# EAGLE design AC dimmer HLK (EAGLE 7.3.0)
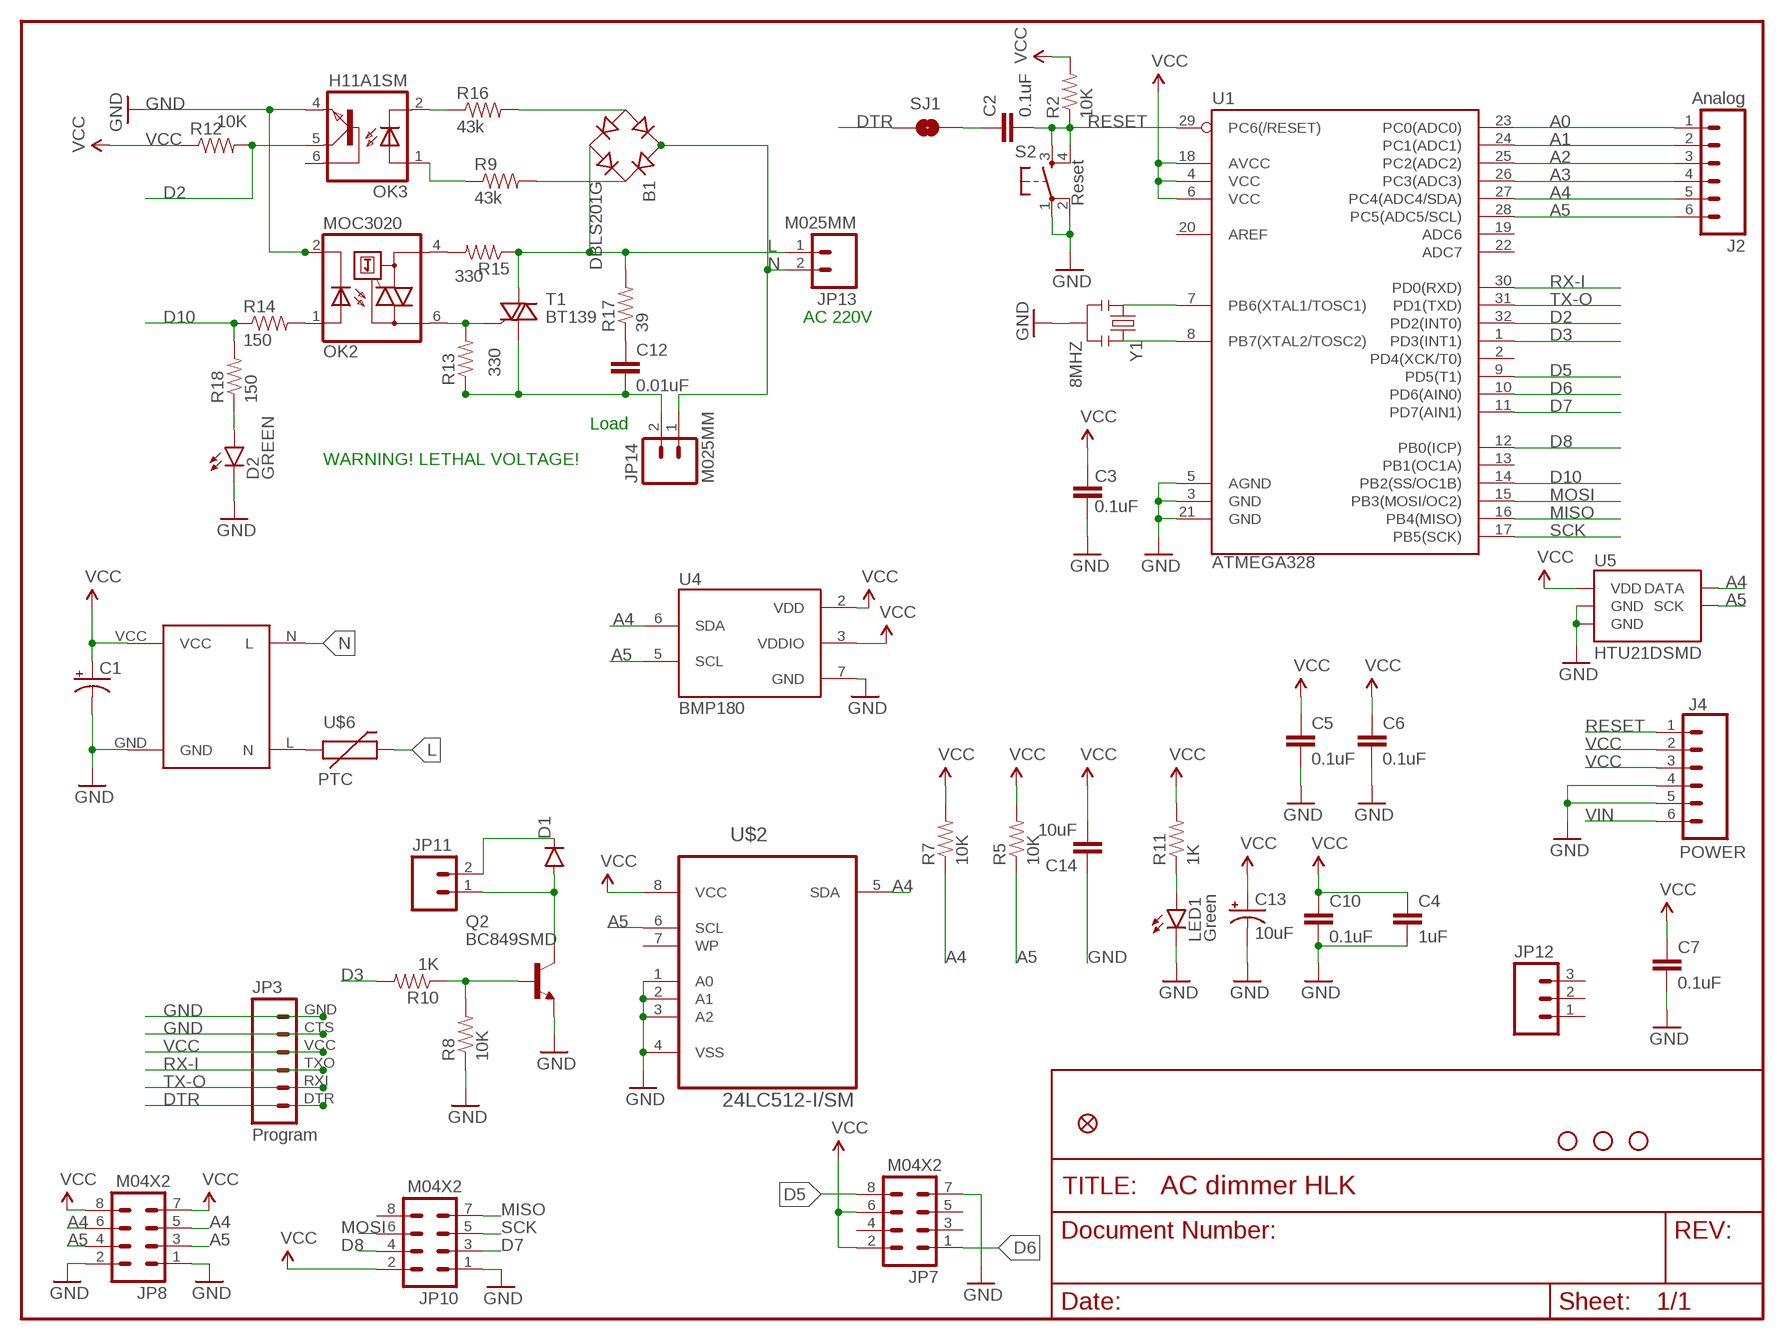
[diagram p0: schematic, sheet 1]

## Parts
B1  DBLS201G  [DBS]
C1  CAP_POL3528-KIT  [EIA3528-KIT]
C2  0.1uF  CAP0805  [0805]
C3  0.1uF  CAP0805  [0805]
C4  1uF  CAP0805  [0805]
C5  0.1uF  CAP0805  [0805]
C6  0.1uF  CAP0805  [0805]
C7  0.1uF  CAP0805  [0805]
C10  0.1uF  CAP0805  [0805]
C12  0.01uF  C-EUC1206  [C1206]
C13  10uF  CAP_POL1206  [EIA3216]
C14  10uF  CAP1206  [1206]
D1  DIODESOD  [SOD-323]
D2  GREEN  LED0603  [LED-0603]
J2  Analog  M06SIP  [1X06]
J4  POWER  M06SIP  [1X06]
JP2  FIDUCIAL1X2.5  [FIDUCIAL-1X2.5]
JP3  Program  M06SIP  [1X06]
JP7  M04X2  [2X4]
JP8  M04X2  [2X4]
JP10  M04X2  [2X4]
JP11  M02PTH  [1X02]
JP12  M03PTH  [1X03]
JP13  M025MM  [SCREWTERMINAL-5MM-2]
JP14  M025MM  [SCREWTERMINAL-5MM-2]
LED1  Green  LED0603  [LED-0603]
OK2  MOC3020  MOC3031S  [DIL6-SMD]
OK3  H11A1SM  [DIL6-SMD]
Q2  BC849SMD  [SOT23-BEC]
R2  10K  RESISTOR0805-RES  [0805]
R5  10K  RESISTOR0805-RES  [0805]
R7  10K  RESISTOR0805-RES  [0805]
R8  10K  RESISTOR0805-RES  [0805]
R9  43k  RESISTOR1206  [1206]
R10  1K  RESISTOR0805-RES  [0805]
R11  1K  RESISTOR0805-RES  [0805]
R12  RESISTOR0805-RES  [0805]
R13  RESISTOR1206  [1206]
R14  150  RESISTOR0805-RES  [0805]
R15  RESISTOR1206  [1206]
R16  43k  RESISTOR1206  [1206]
R17  39  RESISTOR1206  [1206]
R18  150  RESISTOR0805-RES  [0805]
S2  Reset  TAC_SWITCHSMD  [TACTILE_SWITCH_SMD]
SJ1  SOLDERJUMPERNC2  [SJ_2S-NOTRACE]
T1  BT139  BT136  [TO220AB]
U1  ATMEGA328  ATMEGA168  [TQFP32-08]
U4  BMP180  [BMP180]
U5  HTU21DSMD  [HTU21D]
U$2  24LC512-I/SM  [SOIC127P794X203-8N]
U$3  STAND-OFFTIGHT  [STAND-OFF-TIGHT]
U$5  AC-DCHLK01  [HLK-PM01]
U$6  PTC  [MC331XX]
U$9  STAND-OFFTIGHT  [STAND-OFF-TIGHT]
U$10  STAND-OFFTIGHT  [STAND-OFF-TIGHT]
Y1  8MHZ  RESONATOR8MHZ  [RESONATOR-SMD]

## Nets
A0: J2.1 U1.23(PC0(ADC0))
A1: J2.2 U1.24(PC1(ADC1))
A2: J2.3 U1.25(PC2(ADC2))
A3: J2.4 U1.26(PC3(ADC3))
A4: J2.5 JP8.5 JP8.6 R7.1 U1.27(PC4(ADC4/SDA)) U4.6(SDA) U5.DATA U$2.5(SDA)
A5: J2.6 JP8.3 JP8.4 R5.1 U1.28(PC5(ADC5/SCL)) U4.5(SCL) U5.SCK U$2.6(SCL)
D2: OK3.5(COL) R12.2 U1.32(PD2(INT0))
D3: R10.2 U1.1(PD3(INT1))
D5: JP7.8 U1.9(PD5(T1))
D6: JP7.1 U1.10(PD6(AIN0))
D7: JP10.3 U1.11(PD7(AIN1))
D8: JP10.4 U1.12(PB0(ICP))
D10: R14.1 R18.2 U1.14(PB2(SS/OC1B))
DTR: JP3.DTR SJ1.1
GND [vcc]: C1.C(-) C3.1 C4.2 C5.2 C6.2 C7.2 C10.2 C13.C(-) C14.1 D2.C J4.4 J4.5 JP3.CTS JP3.GND JP7.7 JP8.1 JP8.2 JP10.1 LED1.C OK2.2(C) OK3.4(EMI) Q2.E R8.1 S2.1 S2.2 U1.3(GND) U1.5(AGND) U1.21(GND) U4.7(GND) U5.7(GND) U5.GND U$2.1(A0) U$2.2(A1) U$2.3(A2) U$2.4(VSS) U$5.GND Y1.2
L: B1.AC2 JP13.1 R15.1 R17.2 T1.2(A2) U$6.P$2
MISO: JP10.7 U1.16(PB4(MISO))
MOSI: JP10.6 U1.15(PB3(MOSI/OC2))
N: B1.AC1 JP13.2 JP14.1 U$5.N(L)
N$1: C2.1 SJ1.2
N$3: U1.7(PB6(XTAL1/TOSC1)) Y1.1
N$4: U1.8(PB7(XTAL2/TOSC2)) Y1.3
N$5: OK3.1(A) R9.1
N$6: U$5.L(N) U$6.P$1
N$7: OK3.2(C) R16.1
N$8: LED1.A R11.1
N$9: B1.- R16.2
N$12: D1.A JP11.1 Q2.C
N$13: D1.C JP11.2
N$14: Q2.B R8.2 R10.1
N$16: B1.+ R9.2
N$28: C12.2 JP14.2 R13.1 T1.1(A1)
N$29: OK2.6(A2) R13.2 T1.3(G)
N$31: OK2.4(A1) R15.2
N$33: OK2.1(A) R14.2
N$37: C12.1 R17.1
N$38: D2.A R18.1
RESET: C2.2 J4.1 R2.1 S2.3 S2.4 U1.29(PC6(/RESET))
RX-I: JP3.TXO U1.30(PD0(RXD))
SCK: JP10.5 U1.17(PB5(SCK))
TX-O: JP3.RXI U1.31(PD1(TXD))
VCC: C1.A(+) C3.2 C4.1 C5.1 C6.1 C7.1 C10.1 C13.A(+) C14.2 J4.2 J4.3 JP3.VCC JP7.2 JP7.6 JP8.7 JP8.8 JP10.2 R2.2 R5.2 R7.2 R11.2 R12.1 U1.4(VCC) U1.6(VCC) U1.18(AVCC) U4.2(VDD) U4.3(VDDIO) U5.VDD U$2.8(VCC) U$5.VCC
VIN [vcc]: J4.6
Unconnected: JP7.3 JP7.4 JP7.5 JP10.8 JP12.1 JP12.2 JP12.3 OK3.6(BAS) U1.2(PD4(XCK/T0)) U1.13(PB1(OC1A)) U1.19(ADC6) U1.20(AREF) U1.22(ADC7) U$2.7(WP)

## Notes on the sheet
- AC 220V
- Load
- WARNING! LETHAL VOLTAGE!

## Library data of the parts
B1 = rectifier:DB?*G: Single Phase 1.0 AMP Glass Passivated Bridge Rectifier Taiwan Semiconductor Co.,Ltd. - TSC Source: http://www.taiwansemi.com/TSCbig5/ezcatfiles/cust/img/img/db101g.pdf http://www.ts.com.tw/db/pictures/modules/PDT/PDT060207001/DBLS201G.pdf
C1 = SparkFun-Capacitors:CAP_POL: Capacitor Polarized These are standard SMD and PTH capacitors. Normally 10uF, 47uF, and 100uF in electrolytic and tantalum varieties. Always verify the external diameter of the through hole cap, it varies with capacity, voltage, and manufacturer. The EIA devices should be standard.
C2-C7 C10 = SparkFun:CAP: Capacitor Standard 0603 ceramic capacitor, and 0.1" leaded capacitor.
C12 = rcl:C-EU: CAPACITOR, European symbol
C13 = SparkFun:CAP_POL: Capacitor Polarized These are standard SMD and PTH capacitors. Normally 10uF, 47uF, and 100uF in electrolytic and tantalum varieties. Always verify the external diameter of the through hole cap, it varies with capacity, voltage, and manufacturer. The EIA devices should be standard.
C14 = SparkFun-Capacitors:CAP: Capacitor Standard 0603 ceramic capacitor, and 0.1" leaded capacitor.
D1 = SparkFun-DiscreteSemi:DIODE: Diode These are standard reverse protection diodes and small signal diodes. SMA package can handle up to about 1A. SOD-323 can handle about 200mA. What the SOD-323 package when ordering, there are some mfgs out there that are 5-pin packages.; PROD_ID: DIO-09646
D2 LED1 = SparkFun-LED:LED: LEDs Standard schematic elements and footprints for 5mm, 3mm, 1206, and 0603 sized LEDs. 5mm - Spark Fun Electronics SKU : COM-00529 (and others)
J2 J4 = SparkFun:M06: Header 6 Standard 6-pin 0.1" header. Use with straight break away headers (SKU : PRT-00116), right angle break away headers (PRT-00553), swiss pins (PRT-00743), machine pins (PRT-00117), and female headers (PRT-00115). Molex polarized connector foot print use with SKU : PRT-08094 with associated ...
JP2 = abes:FIDUCIAL: Fiducial Alignment Points Various fiducial points for machine vision alignment.
JP3 = SparkFun-Connectors:M06: Header 6 Standard 6-pin 0.1" header. Use with straight break away headers (SKU : PRT-00116), right angle break away headers (PRT-00553), swiss pins (PRT-00743), machine pins (PRT-00117), and female headers (PRT-00115). Molex polarized connector foot print use with SKU : PRT-08094 with associated ...
JP7 JP8 JP10 = SparkFun-Connectors:M04X2: .1" header, two rows of four.
JP11 = SparkFun-Connectors:M02: Standard 2-pin 0.1" header. Use with - straight break away headers ( PRT-00116) - right angle break away headers (PRT-00553) - swiss pins (PRT-00743) - machine pins (PRT-00117) - female headers (PRT-00115) Molex polarized connector foot print use with: PRT-08233 with associated crimp pins and housings. 2.54_SCREWTERM for use with PRT-10571. 3.5mm Screw Terminal footprints for PRT-08084 5mm Screw Terminal footprints for use with PRT-08432
JP12 = SparkFun-Connectors:M03: Header 3 Standard 3-pin 0.1" header. Use with straight break away headers (SKU : PRT-00116), right angle break away headers (PRT-00553), swiss pins (PRT-00743), machine pins (PRT-00117), and female headers (PRT-00115). Molex polarized connector foot print use with SKU : PRT-08232 with associated crimp pins and housings.
JP13 JP14 = SparkFun-Connectors:M02: Standard 2-pin 0.1" header. Use with - straight break away headers ( PRT-00116) - right angle break away headers (PRT-00553) - swiss pins (PRT-00743) - machine pins (PRT-00117) - female headers (PRT-00115) Molex polarized connector foot print use with: PRT-08233 with associated crimp pins and housings. 2.54_SCREWTERM for use with PRT-10571. 3.5mm Screw Terminal footprints for PRT-08084 5mm Screw Terminal footprints for use with PRT-08432; STOREFRONT_ID: PRT-08432
OK2 = optocoupler:MOC30*: 6-Pin DIP Zero-Cross Optoisolators Triac Driver Output (250/400 Volt Peak) Source: Data sheet <http://www.fairchildsemi.com/ds/MO/MOC3031M.pdf> The old path of data sheet not more available 2013-05-06.; MF: FAIRCHILD SEMICONDUCTOR; MPN: MOC3031SM; OC_FARNELL: unknown; OC_NEWARK: 34C1335
OK3 = optocoupler:H11A*?M: General Purpose 6-Pin Phototransistor Optocouplers Source: http://www.fairchildsemi.com/ds/4N/4N35-M.pdf; OC_FARNELL: unknown; OC_NEWARK: unknown
Q2 = transistor-npn:BC849*: NPN Transistor
R2 R5 R7 R8 R10 R11 = SparkFun:RESISTOR: Resistor Basic schematic elements and footprints for 0603, 1206, and PTH resistors.
R9 R16 R17 = SparkFun-Resistors:RESISTOR: Resistor Basic schematic elements and footprints for 0603, 1206, and PTH resistors.; K: 45K
R12 = SparkFun-Resistors:RESISTOR: Resistor Basic schematic elements and footprints for 0603, 1206, and PTH resistors.; OHM: 10K
R13-R15 R18 = SparkFun-Resistors:RESISTOR: Resistor Basic schematic elements and footprints for 0603, 1206, and PTH resistors.; OHM: 330
S2 = SparkFun:TAC_SWITCH: Momentary Switch Button commonly used for reset or general input. Spark Fun Electronics SKU : COM-00097
SJ1 = SparkFun:SOLDERJUMPER: Solder Jumper Standard SMD solder jumper. Used to automate production. Two varients : Normally Open and Normally Closed are the same, but have different paste layers. NC will have a large amount of paste and should jumper during reflow.
T1 = triac:BT136: Triac BT136 series E sensitive gate Source: http://www.nxp.com/acrobat_download/datasheets/BT136_SERIES_E_2.pdf
U1 = SparkFun:ATMEGA168
U4 = SparkFun-Sensors:BMP180: BOSCH BMP180 DIGITAL BAROMETRIC PRESSURE SENSOR Web page: http://www.bosch-sensortec.com/en/homepage/products_3/environmental_sensors_1/bmp180_1/bmp180 Datasheet: http://ae-bst.resource.bosch.com/media/products/dokumente/bmp180/BST-BMP180-DS000-09.pdf The BMP180 is the function compatible successor of the BMP085, a new generation of high precision digital pressure sensors for consumer applications. The ultra-low power, low voltage electronics of the BMP180 is optimized for use in mobile phones, PDAs, GPS navigation devices and outdoor equipment. With a low altitude noise of merely 0.25m at fast conversion time, the BMP180 offers superior performance. The I2C interface allows for easy system integration with a microcontroller. The BMP180 is based on piezo-resistive technology for EMC robustness, high accuracy and linearity as well as long term stability. Key features: - Temperature measurement included - I2C interface - Fully calibrated - Pb-free, halogen-free and RoHS compliant, - MSL 1 Basic specs: Pressure range: 300 to 1100hPa (+9000m to -500m relating to sea level) Supply voltage: 1.8 to 3.6V (VDD), 1.62V to 3.6V (VDDIO) Package: LGA package with metal lid Small footprint: 3.6mm x 3.8mm Super-flat: 0.93mm height Low power: 5μA at 1 sample / sec. in standard mode Low noise: 0.06hPa (0.5m) in ultra low power mode, 0.02hPa (0.17m) advanced resolution mode Typical applications: - Enhancement of GPS navigation (dead-reckoning, slope detection, etc.) - In- and out-door navigation - Leisure and sports - Weather forecast - Vertical velocity indication (rise/sink speed)
U5 = SparkFun-Sensors:HTU21D
U$2 = 24LC512-I:24LC512-I/SM: 512K I2C Serial EEPROM; MPN: 24LC512-I/SM; OC_FARNELL: 9758038; OC_NEWARK: 62K0582; PACKAGE: SOIC-8; SUPPLIER: MICROCHIP
U$3 U$9 U$10 = SparkFun-Electromechanical:STAND-OFF: #4 Stand Off This is the mechanical footprint for a #4 phillips button head screw. Use the keepout ring to avoid running the screw head into surrounding components. SKU : PRT-00447
U$5 = Moja Knjižnica:AC-DCHLK01
U$6 = GeekAmmo:PTC: PTC Resettable Fuse
Y1 = SparkFun-FreqCtrl:RESONATOR: Resonator Small SMD resonator. Used, eg, on the Arduino Pro/ Pro Mini boards. 8MHz- XTAL-08895 16MHz- XTAL-08900; PROD_ID: XTAL-08895

## Net classes
0 default: width 0.203 mm
1 vcc: width 0.254 mm

## Board
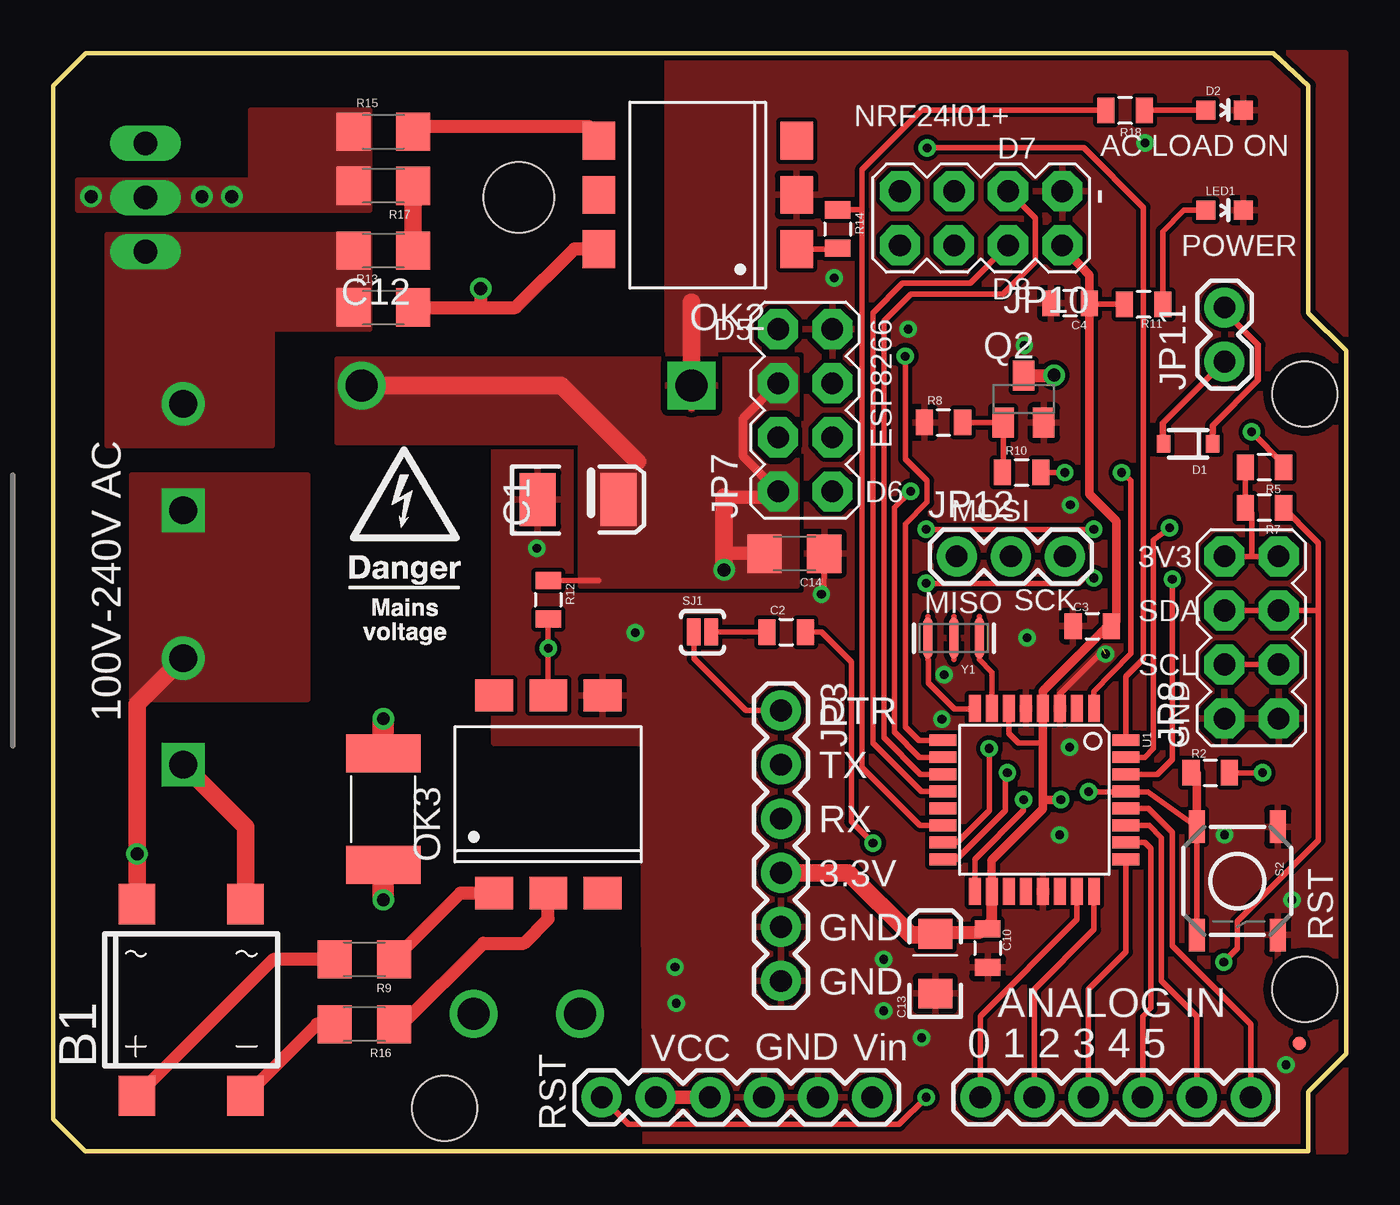
[diagram p1: board, top side]
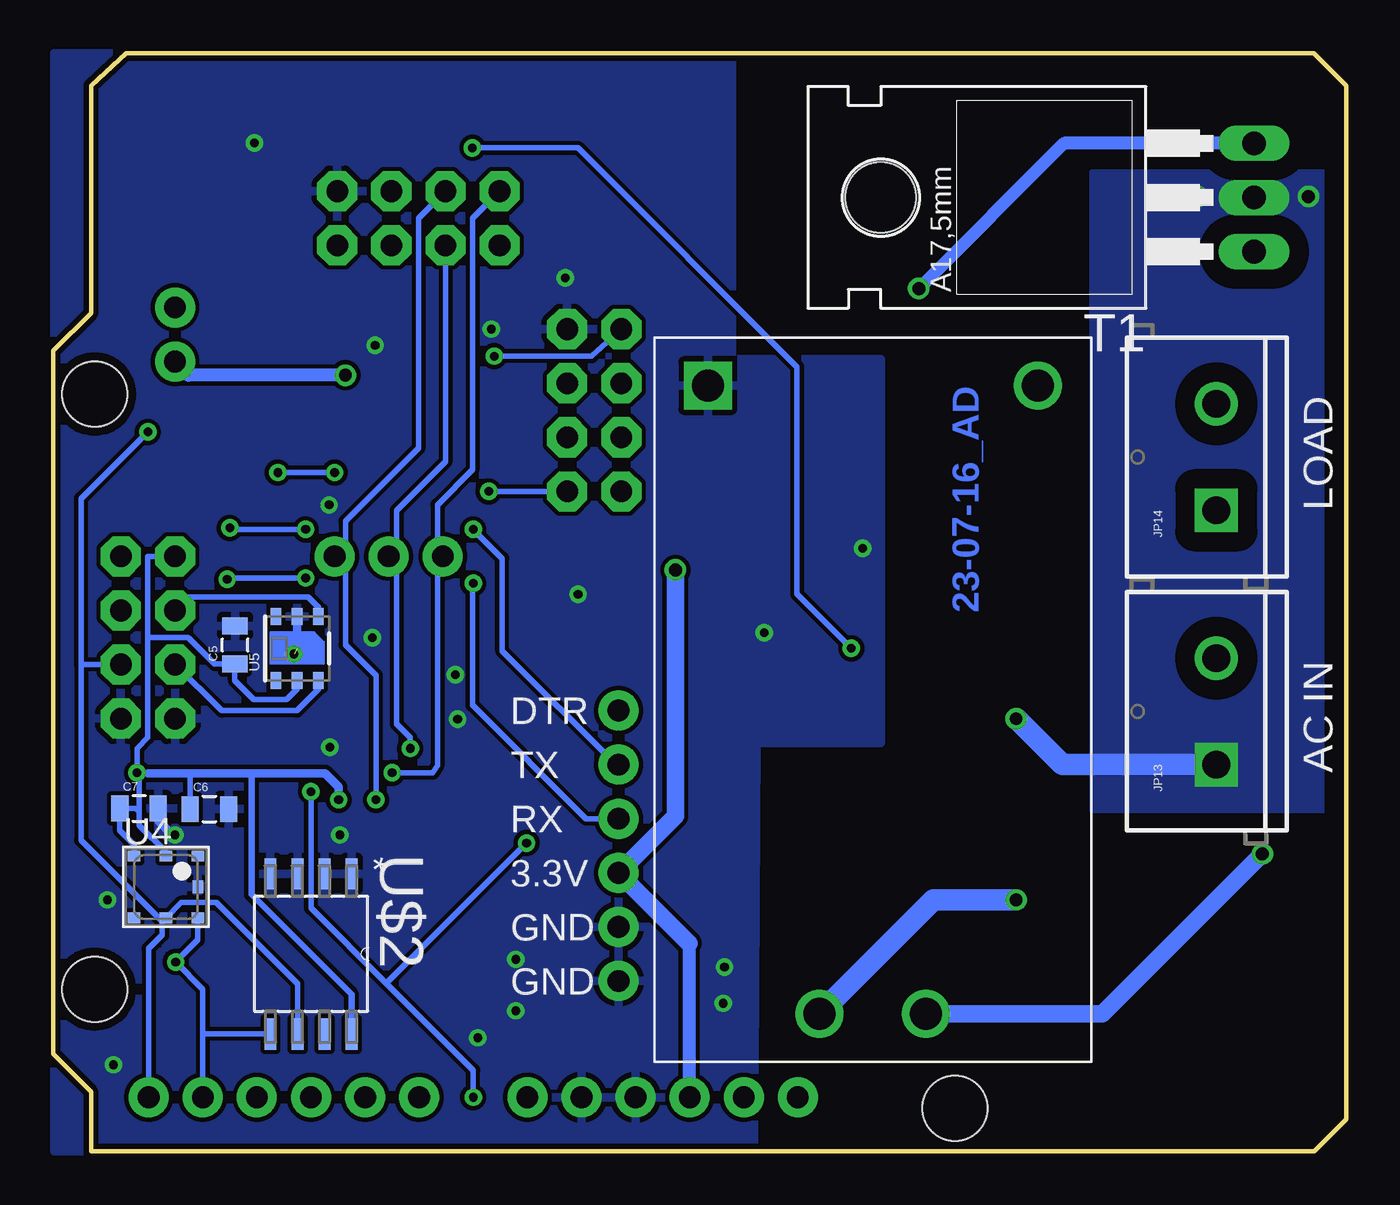
[diagram p2: board, bottom side, seen from below]

Size 60.71 x 51.56 mm. Coordinates in mm from the lower left corner, seen from the top.
Outline: 0,50.04 0,1.5 1.5,0 58.93,0 58.93,2.79 60.71,4.57 60.71,37.59 58.93,39.37 58.93,50.04 57.28,51.56 1.52,51.56 0,50.04
Copper layers (1*16): Top 0.035mm / dielectric 1.5mm / Bottom 0.035mm
Design rules "default *": minimum track width 10mil, minimum drill 24mil, track to track 8mil, track to pad 8mil, pad to pad 8mil, via to via 8mil, smd to smd 8mil, copper to edge 10mil, drill to drill 8mil, minimum pad ring 10mil, minimum via ring 8mil, stop-mask expansion 4mil, vias tented up to drill 20mil, thermal gap 10mil

### Footprints (pad centres in the part's own frame; a part is rotated, then mirrored left to right if it is on the bottom)
DBS = smd 1.7 x 1.9: + -2.55,-4.5; - 2.55,-4.5; AC1 -2.55,4.5; AC2 2.55,4.5
EIA3528-KIT = smd 1.7 x 2.5: A 1.9,0; C -1.9,0
0805 = smd 0.8 x 1.2: 1 -0.9,0; 2 0.9,0
C1206 = smd 1.6 x 1.8: 1 -1.4,0; 2 1.4,0
EIA3216 = smd 1.4 x 1.6: A 1.4,0; C -1.4,0
1206 = smd 1.6 x 1.8: 1 -1.4,0; 2 1.4,0
SOD-323 = smd 0.63 x 0.83: A 1.15,0; C -1.15,0
LED-0603 = smd 0.9 x 0.9: A 0,-0.877; C 0,0.877
1X06 = drill 1.016 pad 1.88: 1 0,0; 2 2.54,0; 3 5.08,0; 4 7.62,0; 5 10.16,0; 6 12.7,0
FIDUCIAL-1X2.5 = smd 0.635 x 0.635: 1 0,0
1X06' = drill 1.016 pad 1.88: CTS 10.16,0; DTR 0,0; GND 12.7,0; RXI 2.54,0; TXO 5.08,0; VCC 7.62,0
2X4 = drill 1.016 pad 1.88 octagon: 1 -3.81,-1.27; 2 -3.81,1.27; 3 -1.27,-1.27; 4 -1.27,1.27; 5 1.27,-1.27; 6 1.27,1.27; 7 3.81,-1.27; 8 3.81,1.27
1X02 = drill 1.016 pad 1.88: 1 0,0; 2 2.54,0
1X03 = drill 1.016 pad 1.88: 1 0,0; 2 2.54,0; 3 5.08,0
SCREWTERMINAL-5MM-2 = drill 1.3 pad 2.032 square: 1 0,0 | drill 1.3 pad 2.032: 2 5,0
DIL6-SMD = smd 1.78 x 1.52: 1 -2.54,-4.645; 2 0,-4.645; 3 2.54,-4.645; 4 2.54,4.645; 5 0,4.645; 6 -2.54,4.645
SOT23-BEC = smd 1 x 1.4: B -0.95,-1.1; C 0,1.1; E 0.95,-1.1
TACTILE_SWITCH_SMD = smd 1.524 x 0.762: 1 -2.54,1.905; 2 2.54,1.905; 3 -2.54,-1.905; 4 2.54,-1.905
SJ_2S-NOTRACE = smd 0.635 x 1.27: 1 -0.401,0; 2 0.413,0
TO220AB = drill 1.118 long: 1 -2.54,-6.35; 2 0,-6.35; 3 2.54,-6.35 | hole 3.302: 0,11.176
TQFP32-08 = smd 1.27 x 0.559: 1 -4.293,2.8; 2 -4.293,2; 3 -4.293,1.2; 4 -4.293,0.4; 5 -4.293,-0.4; 6 -4.293,-1.2; 7 -4.293,-2; 8 -4.293,-2.8; 17 4.293,-2.8; 18 4.293,-2; 19 4.293,-1.2; 20 4.293,-0.4; 21 4.293,0.4; 22 4.293,1.2; 23 4.293,2; 24 4.293,2.8 | smd 0.559 x 1.27: 9 -2.8,-4.293; 10 -2,-4.293; 11 -1.2,-4.293; 12 -0.4,-4.293; 13 0.4,-4.293; 14 1.2,-4.293; 15 2,-4.293; 16 2.8,-4.293; 25 2.8,4.293; 26 2,4.293; 27 1.2,4.293; 28 0.4,4.293; 29 -0.4,4.293; 30 -1.2,4.293; 31 -2,4.293; 32 -2.8,4.293
BMP180 = smd 0.6 x 0.5: 1 1.5,1.45; 2 0,1.45; 3 -1.5,1.45; 4 -1.5,-1.45; 5 0,-1.45; 6 1.5,-1.45 | smd 0.5 x 0.6: 7 1.5,0
HTU21D = smd 0.2 x 0.2: 7 0,0 | smd 0.8 x 0.5: DATA 1.5,-1; GND 1.5,0; NC@1 -1.5,1; NC@6 1.5,1; SCK -1.5,-1; VDD -1.5,0
SOIC127P794X203-8N = smd 1.473 x 0.559: 1 -3.759,1.905; 2 -3.759,0.635; 3 -3.759,-0.635; 4 -3.759,-1.905; 5 3.759,-1.905; 6 3.759,-0.635; 7 3.759,0.635; 8 3.759,1.905
STAND-OFF-TIGHT = hole 3.048: 0,0
HLK-PM01 = drill 1.5 square: GND 14.75,7.75 | drill 1.5: L -14.75,2.5; N -14.75,-2.5; VCC 14.75,-7.75
MC331XX = smd 1.78 x 3.5: P$1 0,0; P$2 5.23,0
RESONATOR-SMD = smd 0.45 x 1.905: 1 -1.2,0; 2 0,0; 3 1.2,0

### Placement (x,y rotation side)
B1  6.48,7.11 0 top
C1  24.64,30.61 0 top
C2  34.42,24.38 0 top
C3  48.78,24.66 0 top
C4  47.74,39.83 180 top
C5  52.17,23.78 90 bottom
C6  53.37,16.08 0 bottom
C7  56.67,16.11 0 bottom
C10  43.87,9.54 270 top
C12  15.49,42.29 180 top
C13  41.41,8.81 90 top
C14  34.8,28.07 180 top
D1  53.28,33.23 180 top
D2  54.99,48.9 270 top
J2  43.53,2.54 0 top
J4  25.75,2.54 0 top
JP2  58.51,5.08 90 top
JP3  Program  [1X06']  34.16,20.7 270 top
JP7  35.31,34.8 90 top
JP8  56.26,24.13 90 top
JP10  43.56,43.81 180 top
JP11  54.99,37.08 90 top
JP12  42.42,27.94 0 top
JP13  6.1,18.16 90 bottom
JP14  6.1,30.1 90 bottom
LED1  54.99,44.2 270 top
OK2  30.25,44.91 90 top
OK3  23.24,16.76 0 top
Q2  45.55,35.32 0 top
R2  54.32,17.78 0 top
R5  56.86,32.13 180 top
R7  56.86,30.23 180 top
R8  41.8,34.23 0 top
R9  14.61,9.02 180 top
R10  45.47,31.88 0 top
R11  51.18,39.77 180 top
R12  23.24,25.91 270 top
R13  15.49,39.62 0 top
R14  36.83,43.31 270 top
R15  15.49,47.88 0 top
R16  14.61,5.97 180 top
R17  15.49,45.34 180 top
R18  50.33,48.88 180 top
S2  55.59,12.7 270 top
SJ1  30.48,24.38 0 top
T1  10.68,44.79 90 bottom
U1  46.07,16.51 270 top
U4  55.41,12.42 0 bottom
U5  49.25,23.61 90 bottom
U$2  48.61,9.27 270 bottom
U$3  18.38,2.03 0 top
U$4  [WARNING_02]  11.18,22.99 0 top
U$5  22.23,21.21 90 bottom
U$6  15.49,13.46 90 top
U$9  58.77,35.56 0 top
U$10  58.77,7.62 0 top
Y1  42.27,24.11 180 top

### Tracks (layer width: path | path; a pad name or v marks a point on that pad's centre or on a via)
A0
  Top 0.254: U1.23 48.07,10.89 43.53,6.35 | J2.1 43.53,6.35 | 43.54,6.31 43.53,6.35
A1
  Top 0.254: U1.24 48.87,10.42 46.07,7.62 J2.2
A2
  Top 0.254: U1.25 50.36,9.37 48.61,7.62 48.61,2.79 48.73,2.67 J2.3
A3
  Top 0.254: U1.26 51.24,14.51 51.53,14.22 51.53,6.73 51.15,6.35 J2.4
A4  (via drill 0.41)
  Top 0.254: U1.27 51.46,15.31 52.03,14.73 52.03,8 53.69,6.35 J2.5 | R7.1 57.51,30.46 59.4,28.57 59.4,25.4 | 59.4,25.4 JP8.5 JP8.6 | 59.4,25.4 59.4,14.61 55.59,10.79 55.59,9.53 v54.96,8.89
  Bottom 0.254: 53.69,5.46 53.69,7.62 v54.96,8.89 53.91,9.93 U4.6 | 53.69,5.46 J2.5 | U5.DATA 48.26,25.54 48.74,26.02 54.34,26.02 JP8.6 | U$2.5 53.63,5.51 53.69,5.46
A5  (via drill 0.41)
  Top 0.254: U1.28 51.42,16.11 52.54,14.99 52.54,9.65 56.23,5.97 J2.6 | JP8.4 JP8.3 | R5.1 57.76,32.28 v56.26,33.78
  Bottom 0.254: JP8.3 59.4,22.86 | 59.4,22.86 59.4,14.61 55.59,10.79 | J2.6 56.23,9.53 55.59,10.16 55.59,10.79 | 59.4,22.86 59.4,30.66 58.62,31.42 v56.26,33.78 | JP8.4 52.79,20.7 49.26,20.7 48.26,21.71 U5.SCK | 55.59,10.79 U4.5 54.7,11.68 53.05,11.68 49.24,7.87 U$2.6
D2  (via drill 0.41)
  Top 0.254: U1.32 50.36,22.29 51.18,23.11 51.18,44.32 48.39,47.12 v41.02,47.12 | R12.2 v23.24,23.62 OK3.5
  Bottom 0.254: v41.02,47.12 36.07,47.12 25.78,36.83 25.78,26.16 v23.24,23.62
D3  (via drill 0.41)
  Top 0.254: v50.16,31.88 50.6,31.5 50.59,23.53 50.59,23.37 48.87,21.6 U1.1 | R10.2 v47.5,31.88
  Bottom 0.254: v47.5,31.88 v50.16,31.88
D5  (via drill 0.41)
  Top 0.254: 41.88,19.3 41.78,19.3 40.64,19.3 40.01,19.94 40.01,29.46 41.02,30.48 41.02,31.5 40.01,32.51 v40.01,37.34
  Top 0.406: U1.9 41.78,19.31 41.78,19.3
  Bottom 0.254: JP7.8 35.43,37.34 v40.01,37.34
D6  (via drill 0.41)
  Top 0.254: U1.10 40.67,18.51 39.5,19.68 39.5,30.23 v40.26,30.99
  Bottom 0.254: JP7.1 v40.26,30.99
D7
  Top 0.254: U1.11 40.71,17.71 38.99,19.43 38.99,38.99 40.26,40.26 44.58,40.26 46.1,41.78 46.1,43.81 JP10.3
D8
  Top 0.254: U1.12 40.75,16.91 38.48,19.18 38.48,39.37 39.88,40.77 43.05,40.77 JP10.4
D10
  Top 0.254: U1.14 40.7,15.31 37.98,18.03 37.98,24.64 37.97,25.4 37.97,44.21 | R18.2 40.75,48.88 37.97,46.1 37.97,44.21 | R14.1 37.97,44.21
DTR
  Top 0.254: SJ1.1 30.08,23.13 32.51,20.7 JP3.DTR
GND  (via drill 0.41)  (1 unrouted)
  Top 0.254: C14.1 36.2,26.42 36.2,26.16 v36.07,26.16
  Top 0.305: v49.4,23.35 49.13,23.35 47.27,21.48 U1.3
  Top 0.813: 29.97,35.18 29.97,39.88
  Bottom 0.406: v54.99,14.86 55.14,14.89 55.78,15.54 C7.2 | U5.GND U5.7
  other vias: 41.83,22.38 45.59,37.85 57.88,4.06 47.72,18.97 38.99,9.02 45.72,24.12 40.77,5.33 38.99,6.6 51.25,47.35 58.17,11.81 29.25,6.95 27.32,24.36 29.19,8.65 41.72,20.3 47.75,30.35 36.67,41.02 40.13,38.61 22.7,28.32 47.24,14.86
  pour Top (rank 6): 20.7,37.21 28.83,37.21 28.83,51.56 60.67,51.56 60.67,0 27.81,0 27.69,19.18 20.7,19.18
  pour Bottom: 21.84,37.21 28.83,37.21 28.83,51.56 60.67,51.56 60.67,0 27.81,0 27.69,19.18 21.84,19.18
L  (via drill 0.6)
  Top 0.813: B1.AC2 9.03,15.23 JP13.1
  Top 1.016: U$6.P$2 v15.49,20.32
  Bottom 1.016: JP13.1 13.34,18.16 v15.49,20.32
  other vias: 1.78,44.83 6.99,44.83 8.38,44.83
  pour Bottom (isolate 0.914, no thermals): 0.76,16 0.64,45.97 11.94,45.97 11.94,16
  pour Top (no thermals): 1.14,44.2 14.86,44.2 14.86,48.9 9.27,48.9 9.27,45.59 1.14,45.59
MISO  (via drill 0.41)
  Top 0.254: v44.8,17.78 44.96,17.78 44.7,17.53 44.7,16 42.41,13.71 U1.16
  Bottom 0.254: v44.8,17.78 42.89,17.78 42.67,18.13 42.67,30.35 41.02,32 41.02,43.81 JP10.7
MOSI  (via drill 0.41)
  Top 0.254: 41.88,14.48 41.8,14.48 U1.15 42.45,14.51 43.94,16 v43.94,18.92
  Top 0.406: 41.8,14.48 41.77,14.48
  Bottom 0.254: JP10.6 42.29,32.38 44.58,30.1 44.58,20.07 43.94,19.43 v43.94,18.92
N  (via drill 0.6)
  Top 0.813: JP13.2 3.94,21 v3.94,13.97 3.94,11.62 B1.AC1
  Bottom 0.813: U$5.N 11.45,6.46 v3.94,13.97
  pour Top (isolate 0.61, no thermals): 3.68,21.21 11.94,21.21 11.94,31.75 3.68,31.75
N$1
  Top 0.254: C2.1 32.45,24.38 SJ1.2
N$3
  Top 0.254: U1.7 44.07,22.5 43.47,23.09
N$4
  Top 0.254: U1.8 43.24,20.78 42.3,20.78 41.08,22 41.08,23.09 41.07,23.09
N$5
  Top 0.61: OK3.1 19.11,12.12 R9.1
N$6  (via drill 0.6)
  Top 1.016: U$6.P$1 v15.49,11.81
  Bottom 1.016: v15.49,11.81 19.37,11.81 U$5.L
N$7
  Top 0.61: R16.1 16.38,5.97 20.19,9.78 22.1,9.78 23.24,10.92 OK3.2
N$8
  Top 0.254: R11.1 52.09,43.2 53.09,44.2 LED1.A
N$9
  Top 0.61: R16.2 12.38,5.97 B1.-
N$12  (via drill 0.6)
  Top 0.254: Q2.C 45.59,36.42
  Top 0.305: 52.1,33.36 52.1,33.23 52.1,33.27 | JP11.1 52.1,34.19 52.1,33.27 | D1.A 52.13,33.24 52.1,33.27
  Top 0.61: 45.59,36.42 46.99,36.42 v46.99,36.45
  Bottom 0.61: v46.99,36.45 54.36,36.45 JP11.1
N$13
  Top 0.305: D1.C 54.43,34.08 56.56,36.21 56.56,37.88 54.99,39.45 JP11.2
N$14
  Top 0.254: R8.2 Q2.B 44.6,31.92 R10.1
N$16
  Top 0.61: R9.2 10.33,9.02 B1.+
N$22
  pour Bottom: 43.56,28.32 43.81,28.32 43.81,27.56 43.56,27.56
N$23
  pour Bottom: 46.1,28.32 46.35,28.32 46.35,27.56 46.1,27.56
N$28
  pour Top (isolate 0.406, no thermals): 2.54,43.05 14.86,43.05 14.86,38.61 10.29,38.61 10.29,33.15 2.54,33.15
N$29  (via drill 0.6)
  Top 0.61: R13.2 20.07,39.62 | 20.07,39.62 21.72,39.62 24.46,42.37 OK2.6 | v20.07,40.51 20.07,39.62
  Bottom 0.61: T1.3 13.25,47.33 v20.07,40.51
N$31
  Top 0.61: R15.2 16.89,48.13 25.15,48.13 25.57,47.45 OK2.4
N$33
  Top 0.254: OK2.1 36.7,42.37 R14.2
N$37
  Top 0.813: C12.1 R17.1
N$38
  Top 0.254: D2.A 51.24,48.9 R18.1
RESET  (via drill 0.41)
  Top 0.254: J4.1 27.02,1.27 39.72,1.27 v40.99,2.54 | v48.61,16.89 50.26,16.89 50.28,16.91 U1.29 50.49,16.91 50.51,16.89 51.4,16.89 S2.3 S2.4 | C2.2 35.97,24.38 | 35.97,24.38 35.94,24.38 | v38.48,14.48 37.47,15.49 37.47,22.99 36.07,24.38 35.97,24.38
  Top 0.406: R2.1 53.69,17.78 S2.3
  Bottom 0.254: 45.07,7.89 40.99,3.81 v40.99,2.54 | 45.07,7.89 48.61,11.43 v48.61,16.89 | v38.48,14.48 45.07,7.89
RX-I  (via drill 0.41)
  Top 0.254: U1.30 51.84,17.71 52.54,18.41 v52.54,26.86 | v40.99,26.67 48.13,26.67 48.39,26.92 v48.86,26.92
  Bottom 0.254: v52.54,26.86 52.29,26.92 v48.86,26.92 | JP3.TXO 35.69,15.62 41.02,20.95 41.02,26.64 v40.99,26.67
SCK  (via drill 0.41)
  Top 0.254: v45.56,16.51 45.56,16 43.27,13.71 U1.17
  Bottom 0.254: v45.56,16.51 45.56,22.35 46.99,23.78 46.99,29.59 43.56,33.02 43.56,43.81 JP10.5
TX-O  (via drill 0.41)
  Top 0.254: U1.31 51.24,18.51 51.65,18.92 51.65,28.7 v52.42,29.27 | v40.99,29.21 v48.86,29.21
  Bottom 0.254: v52.42,29.27 52.16,29.21 v48.86,29.21 | JP3.RXI 34.29,18.16 39.62,23.5 39.62,27.85 v40.99,29.21
VCC  (via drill 0.41, 0.6)
  Top 0.254: 43.53,10.29 C10.1 | U1.18 44.06,12.22 | 46.47,20.9 U1.4 | U1.6 44.87,19.61 45.3,19.18 46.47,19.18 | R2.2 v56.77,17.78 | JP8.8 56.26,27.94 | 56.26,27.94 JP8.7 | R5.2 R7.2 56.26,29.97 56.26,27.94 | R11.2 48.7,39.77 C4.1 | R12.1 25.6,26.81
  Top 0.406: 44.06,12.22 44.05,13.66 46.46,16.07 46.47,16.51 | 46.47,16.51 46.47,19.18 U1.4 | 46.47,16.51 v47.31,16.51 | C4.1 48.65,40.33 48.65,41.15 47.34,42.52 JP10.2 | 48.61,39.37 C4.1 | U1.4 46.47,20.83 46.47,21.61 49.52,24.66 C3.2 49.91,24.89 49.91,29.59 48.64,30.86 C4.1 | J4.3 31.24,2.54 | JP7.6 32.38,34.42 32.38,32.64 JP7.2
  Top 0.508: U1.18 44.07,10.83 43.53,10.29
  Top 0.61: 41.11,10.29 43.53,10.29 | 41.16,10.27 C13.A 41.35,10.16 | JP7.2 33.78,30.73 31.5,30.73 31.49,28.07 C14.2
  Top 0.635: 41.11,10.29 C13.A | J4.2 J4.3
  Top 0.813: JP3.VCC 37.34,13.08 40.26,10.16 41.35,10.16 | U$5.VCC 23.86,35.96 27.43,32.38 | v31.5,27.3 31.5,30.73
  Bottom 0.254: 56.25,17.75 v56.77,17.78 | JP8.8 56.26,27.94 56.26,24.13 | 56.26,24.13 56.26,19.43 56.77,18.92 v56.77,17.78 | 56.26,24.13 56.11,24.13 54.4,24.13 54.37,24.1 54.34,24.1 53.12,22.88 C5.1 52.18,22.11 51.29,21.22 49.75,21.22 49.26,21.72 U5.VDD | U4.2 55.41,14.06 56.67,15.32 56.67,15.96 | 56.67,15.96 56.67,17.76 v56.77,17.78 | 56.67,15.96 56.82,16.11 C7.1 57.59,16.09 57.59,15.06 56.91,14.39 U4.3 | C6.1 54.27,17.68 54.35,17.75
  Bottom 0.305: U$2.8 46.7,7.37 51.4,12.06 51.4,17.75
  Bottom 0.406: v47.31,16.51 47.31,17.12 47.95,17.75 51.4,17.75 54.35,17.75 56.25,17.75
  Bottom 0.61: 30.86,9.78 30.86,2.58 J4.3
  Bottom 0.813: 30.86,9.78 JP3.VCC 31.5,15.75 v31.5,27.3
  pour Top (isolate 0.305, no thermals): 13.34,37.21 34.92,37.21 34.92,26.54 24.77,26.54 24.77,33.27 13.34,33.27

### Text on the board
Bottom: 23-07-16_AD
tPlace: NRF24l01+ | D7 | AC LOAD ON | - | POWER | D8 | D5 | ESP8266 | D6 | MOSI | 3V3 | MISO | SCK | SDA | SCL | 100V-240V AC | DTR | GND | TX | RX | 3.3V | GND | RST | GND | Vin | ANALOG IN | VCC | GND | 0 1 2 3 4 5 | RST
bPlace: LOAD | DTR | AC IN | TX | RX | 3.3V | GND | GND
tValues: DNP | DNP | JST-Right Angle | DNP | Production: DNP | Production: DNP | Proto: 2x3 male header up | DNP | DNP | DNP